# EAGLE schematic DRV8833 (EAGLE 6.4)
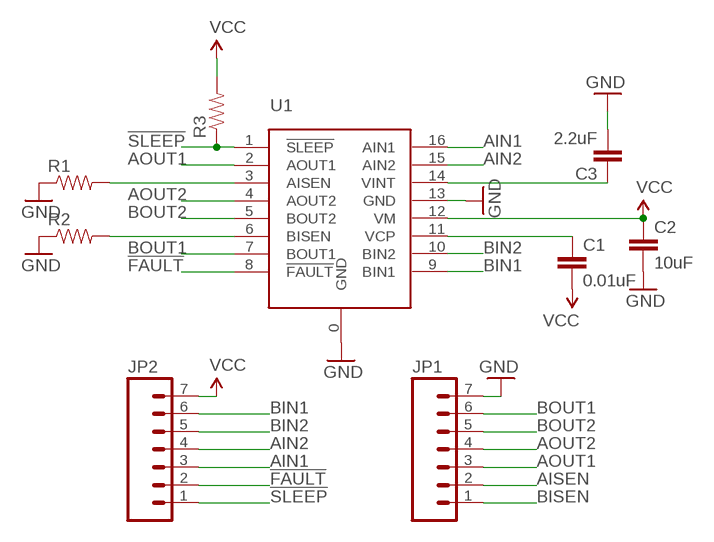
[diagram p0: schematic, sheet 1]

## Parts
C1  0.01uF  CAP0603-CAP  [0603-CAP]
C2  10uF  CAP1206  [1206]
C3  2.2uF  CAP0603-CAP  [0603-CAP]
JP1  M07  [1X07]
JP2  M07  [1X07]
R1  RESISTOR1206  [1206]
R2  RESISTOR1206  [1206]
R3  RESISTOR0603-RES  [0603-RES]
U1  DRV8833  [PWP16]

## Nets
!FAULT: JP2.2 U1.8(!FAULT)
!SLEEP: JP2.1 R3.1 U1.1(!SLEEP)
AIN1: JP2.3 U1.16(AIN1)
AIN2: JP2.4 U1.15(AIN2)
AISEN: JP1.2 R1.2 U1.3(AISEN)
AOUT1: JP1.3 U1.2(AOUT1)
AOUT2: JP1.4 U1.4(AOUT2)
BIN1: JP2.6 U1.9(BIN1)
BIN2: JP2.5 U1.10(BIN2)
BISEN: JP1.1 R2.2 U1.6(BISEN)
BOUT1: JP1.6 U1.7(BOUT1)
BOUT2: JP1.5 U1.5(BOUT2)
GND: C2.2 C3.2 JP1.7 R1.1 R2.1 U1.0(GND) U1.13(GND)
N$14: C1.1 U1.11(VCP)
N$63: C3.1 U1.14(VINT)
VCC: C1.2 C2.1 JP2.7 R3.2 U1.12(VM)

## Library data of the parts
C1-C3 = SparkFun-Passives:CAP: Capacitor Standard 0603 ceramic capacitor, and 0.1" leaded capacitor.
JP1 JP2 = SparkFun-Connectors:M07: Header 7 Standard 7-pin 0.1" header. Use with straight break away headers (SKU : PRT-00116), right angle break away headers (PRT-00553), swiss pins (PRT-00743), machine pins (PRT-00117), and female headers (PRT-00115). NOTES ON THE VARIANTS LOCK and LOCK_LONGPADS... This footprint was designed to help hold the alignment of a through-hole component (i.e. 7-pin header) while soldering it into place. You may notice that each hole has been shifted either up or down by 0.005 of an inch from it's more standard position (which is usually a perfectly straight line). This slight alteration caused the pins (the squares in the middle) to touch the edges of the holes. Because they are alternating, it causes a "brace" to hold the header in place. 0.005 has proven to be the perfect amount of "off-center" position when using our standard breakaway headers. Although looks a little odd when you look at the bare footprint, once you have a header in there, the alteration is very hard to notice. Also, if you push a header all the way into place, it is covered up entirely on the bottom side. This idea of altering the position of holes to aid alignment will be further integrated into the Sparkfun Library for other footprints. It can help hold any component with 3 or more connection pins.
R1-R3 = SparkFun-Passives:RESISTOR: Resistor Basic schematic elements and footprints for 0603, 1206, and PTH resistors.
U1 = DRV8833:DRV8833